# Altium schematic sheet Arduino_extension_connectors.SchDoc: Connectors
size A4; CompanyName: STMicroelectronics; Organization: Microcontrollers Division; SheetNumber: 5; SheetTotal: 8
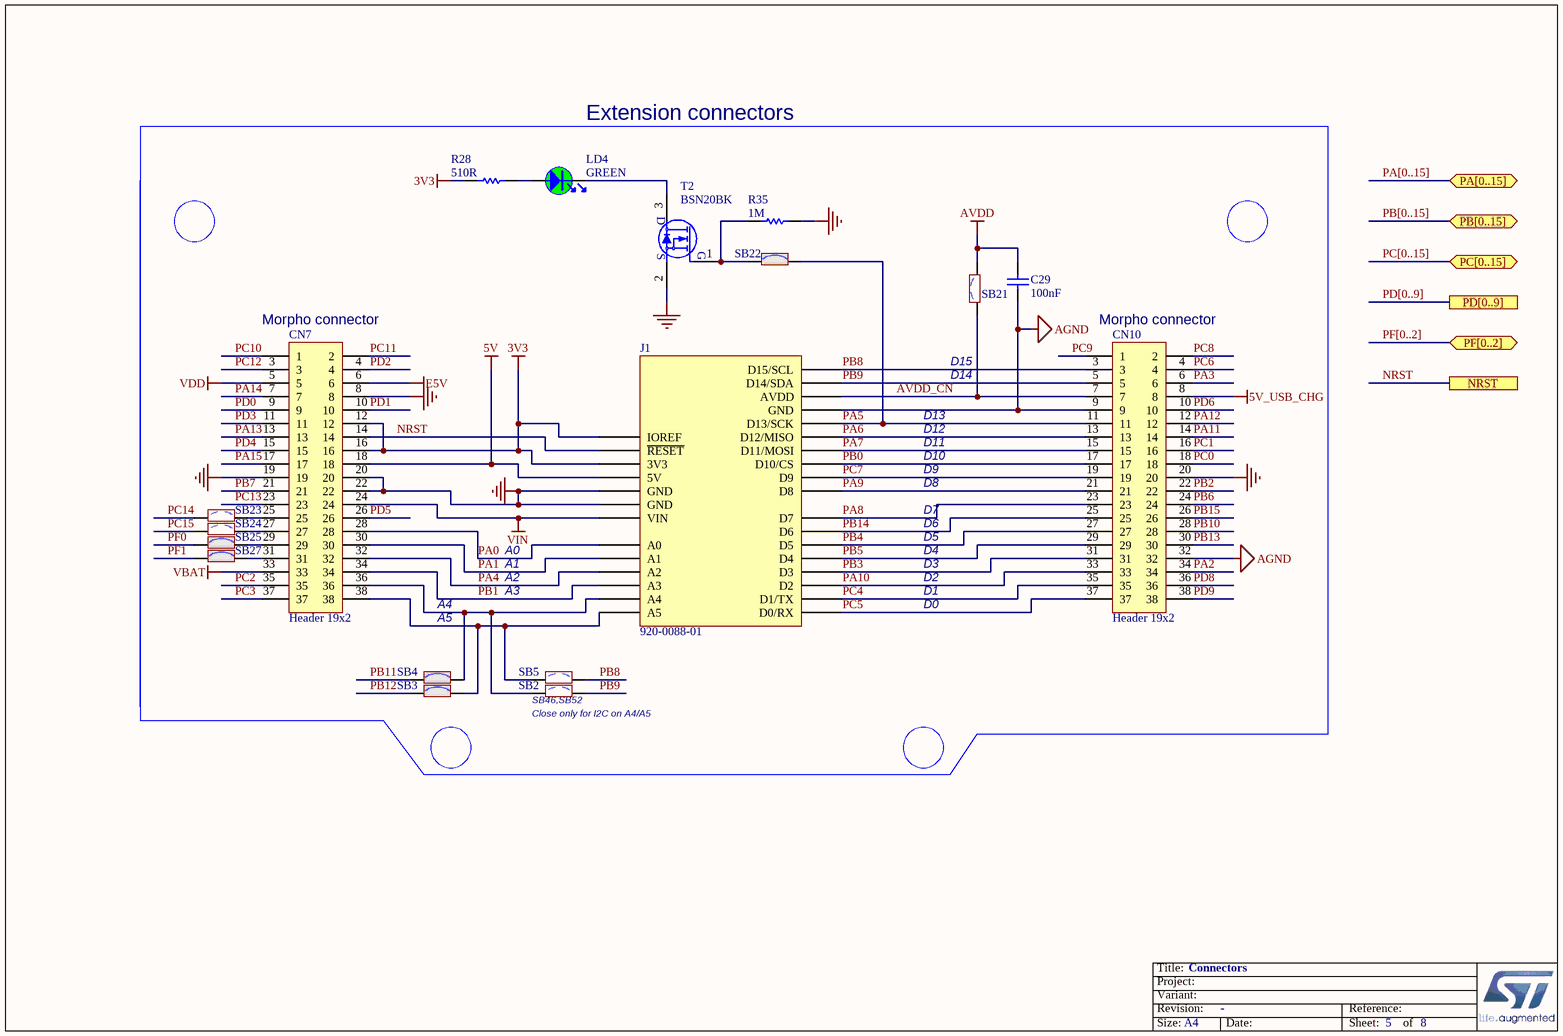
[diagram p0: Arduino_extension_connectors.SchDoc]

## Parts
C29  value 100nF  [C0603]  (hidden comment: Capacitor)
CN7  Header 19x2  [CON_SAMTEC_TSW-119-09-X-D]
CN10  Header 19x2  [CON_SAMTEC_TSW-119-09-X-D]
J1  920-0088-01  [SCHMARTBOARD - 920-0088-01]
LD4  value GREEN  [LED_0603_GREEN]  (hidden comment: LED_green)
R28  value 510R  [R0603]  (hidden comment: Resistor)
R35  value 1M  [R0603]  (hidden comment: Resistor)
SB2  SB_OFF  [SOLDER-BRIDGE_R0603-0R]  (value not drawn)
SB3  SB_ON  [SOLDER-BRIDGE_R0603-0R]  (value not drawn)
SB4  SB_ON  [SOLDER-BRIDGE_R0603-0R]  (value not drawn)
SB5  SB_OFF  [SOLDER-BRIDGE_R0603-0R]  (value not drawn)
SB21  SB_OFF  [SOLDER-BRIDGE_R0603-0R]  (value not drawn)
SB22  SB_ON  [SOLDER-BRIDGE_R0603-0R]  (value not drawn)
SB23  SB_OFF  [SOLDER-BRIDGE_R0603-0R]  (value not drawn)
SB24  SB_OFF  [SOLDER-BRIDGE_R0603-0R]  (value not drawn)
SB25  SB_ON  [SOLDER-BRIDGE_R0603-0R]  (value not drawn)
SB27  SB_ON  [SOLDER-BRIDGE_R0603-0R]  (value not drawn)
T2  value BSN20BK  [MOS_SOT23]  (hidden comment: BSN20)

## Ports
NRST, PA[0..15] (bidir), PB[0..15] (bidir), PC[0..15] (bidir), PD[0..9], PF[0..2] (bidir)

## Nets
3V3: CN7.12 CN7.16 J1.2(IOREF) J1.4(3V3) R28.2
5V: CN7.18 J1.5(5V)
5V_USB_CHG: CN10.8
AGND: C29.1 CN10.9 CN10.32 J1.29(GND)
AVDD: C29.2 SB21.2
E5V: CN7.6
GND: CN7.8 CN7.19 CN7.20 CN7.22 CN10.20 J1.6(GND) J1.7(GND) R35.2 T2.2(S)
VBAT: CN7.33
VDD: CN7.5
VIN: CN7.24 J1.8(VIN)
AVDD_CN: CN10.7 J1.30(AVDD) SB21.1
NRST: CN7.14 J1.3(~{RESET}) ; port NRST
PA0: CN7.28 J1.9(A0)
PA1: CN7.30 J1.10(A1)
PA2: CN10.34
PA3: CN10.6
PA4: CN7.32 J1.11(A2)
PA5: CN10.11 J1.28(D13/SCK) SB22.2
PA6: CN10.13 J1.27(D12/MISO)
PA7: CN10.15 J1.26(D11/MOSI)
PA8: CN10.23 J1.22(D7)
PA9: CN10.21 J1.23(D8)
PA10: CN10.33 J1.17(D2)
PA11: CN10.14
PA12: CN10.12
PA13: CN7.13
PA14: CN7.7
PA15: CN7.17
PB0: CN10.17 J1.25(D10/CS)
PB1: CN7.34 J1.12(A3)
PB2: CN10.22
PB3: CN10.31 J1.18(D3)
PB4: CN10.27 J1.20(D5)
PB5: CN10.29 J1.19(D4)
PB6: CN10.24
PB7: CN7.21
PB8: CN10.3 J1.32(D15/SCL) SB5.2
PB9: CN10.5 J1.31(D14/SDA) SB2.2
PB10: CN10.28
PB11: SB4.1
PB12: SB3.1
PB13: CN10.30
PB14: CN10.25 J1.21(D6)
PB15: CN10.26
PC0: CN10.18
PC1: CN10.16
PC2: CN7.35
PC3: CN7.37
PC4: CN10.35 J1.16(D1/TX)
PC5: CN10.37 J1.15(D0/RX)
PC6: CN10.4
PC7: CN10.19 J1.24(D9)
PC8: CN10.2
PC9: CN10.1
PC10: CN7.1
PC11: CN7.2
PC12: CN7.3
PC13: CN7.23
PC14: SB23.1
PC15: SB24.1
PD0: CN7.9
PD1: CN7.10
PD2: CN7.4
PD3: CN7.11
PD4: CN7.15
PD5: CN7.26
PD6: CN10.10
PD8: CN10.36
PD9: CN10.38
PF0: SB25.1
PF1: SB27.1
NetCN7_25: CN7.25 SB23.2
NetCN7_27: CN7.27 SB24.2
NetCN7_29: CN7.29 SB25.2
NetCN7_31: CN7.31 SB27.2
NetCN7_36: CN7.36 J1.13(A4) SB2.1 SB4.2
NetCN7_38: CN7.38 J1.14(A5) SB3.2 SB5.1
NetLD4_1: LD4.1 R28.1
NetLD4_2: LD4.2 T2.3(D)
NetR35_1: R35.1 SB22.1 T2.1(G)

## Buses and harness runs
bus PA[0..15] = port PA[0..15]
bus PB[0..15] = port PB[0..15]
bus PC[0..15] = port PC[0..15]
bus PD[0..9] = port PD[0..9]
bus PF[0..2] = port PF[0..2]

## Notes on the sheet
- Extension connectors
- (near CN7) Morpho connector
- D14
- D15
- (near CN10) Morpho connector
- D13
- D12
- D11
- D7
- D8
- D9
- D10
- A0
- A1
- A2
- D2
- D4
- D3
- D5
- D6
- A4
- A5
- A3
- D0
- D1
- (near SB2) Close only for I2C on A4/A5
- (near SB2) SB46,SB52
- Title:
- Project:
- Size:
- Revision:
- Variant:
- -
- Date:
- Reference:
- Sheet:
- of

## Library data of the parts
C29 = MCD-00211: Capacitor, MLCC, 100nF, 16V, X7R, 10%, 0603, T=0,8mm; Manufacturer_Part_Number: CC0603KRX7R7BB104; Manufacturer: YAGEO; ECCN_US: EAR99; ECCN_EU: NEC; Provided_By: SUBCO; Internal_Part_Number: MCD-00211; Status: Released; Part_Type: Capacitor; Package: C0603; ComponentLink1Description: Datasheet; ComponentLink1URL: http://tunmcdsvn.tun.st.com/Component_Datasheet_Library/Trunk/Capacitors/Yageo_Multilayer_Capacitor_X7R_series_100pF_to_22uF
CN7 CN10 = MCD-00213: Header, 19x2, 2,54mm, VR, TH, Height 5.84mm/10.16mm; Manufacturer_Part_Number: TSW-119-09-x-D; Manufacturer: SAMTEC; Part_Type: Connector; Provided_By: SUBCO; Internal_Part_Number: MCD-00213; Value: Header 19x2; ECCN_US: n/a; ECCN_EU: n/a; ComponentLink1Description: Datasheet; Status: Released; ComponentLink1URL: http://tunmcdsvn.tun.st.com/Component_Datasheet_Library/Trunk/Connectors/Samtec_TSW-HTSW-series; Parameter 1: *
J1 = 920-0088-01: CONN HDR 8/10P 0.1 GOLD PCB 6PC; Manufacturer: Schmartboard, Inc.; Connector Type: Header; Contact Length - Post: 0.413" (10.50mm); Number of Positions: 6, 8, 10; Number of Positions Loaded: All; Pitch - Mating: 0.100" (2.54mm); Style: Board to Board; System: Connector; Part Number: 920-0088-01; ComponentLink1Description: Datasheet; ComponentLink1URL: http://schmartboard.com/content/Brochures/920-0088-01.pdf; ComponentLink2Description: DigiKey Link; ComponentLink2URL: http://digikey.com/product-detail/en/schmartboard-inc/920-0088-01/1988-1036-ND/9559319; Contact Finish - Mating: Gold; Contact Finish - Post: Gold; Contact Type: Female Socket; Fastening Type: Push-Pull; Insulation Color: Black; Insulation Height: 0.335" (8.51mm); LastUpdated: 31/01/2020 20:49:58; Lifecycle Status: Active; Minimum Order: 1; Mounting Type: Through Hole; Number of Rows: 1; Packaging: Bulk; Part Status: Active; Price: 5.00; Series: -; Supplier 1: DigiKey; Supplier Part Number 1: 1988-1036-ND; Termination: Solder
LD4 = MCD-00050: LED, Green, 0603; Part_Type: Display; Manufacturer_Part_Number: 19-213SYGC/S530-E2/TR8; Manufacturer: EVERLIGHT; ECCN_US: EAR99; ECCN_EU: NEC; Provided_By: SUBCO; Internal_Part_Number: MCD-00050; Status: Released; ComponentLink1Description: Datasheet; ComponentLink1URL: http://tunmcdsvn.tun.st.com/Component_Datasheet_Library/Trunk/Display/Everlight_SMD-LED-GREEN_19-213SYGC-S530-XX-TR8-v3.doc; Package: LED 0603
R28 = MCD-00225: Resistor,510R,0603,1%,1/10W; Manufacturer_Part_Number: RC0603FR-07510RL; Manufacturer: YAGEO; ECCN_US: EAR99; ECCN_EU: NEC; Provided_By: SUBCO; Internal_Part_Number: MCD-00225; ComponentLink1Description: Datasheet; Status: Released; Part_Type: Resistor; Package: R0603; ComponentLink1URL: http://tunmcdsvn.tun.st.com/Component_Datasheet_Library/Trunk/Resistors/Yageo_Resistor_RC0603-series
R35 = MCD-00257: Resistor,1M,0603,1%,1/10W; Manufacturer_Part_Number: RC0603FR-071ML; Manufacturer: YAGEO; ECCN_US: EAR99; ECCN_EU: NEC; Provided_By: SUBCO; Internal_Part_Number: MCD-00257; Status: Released; Part_Type: Resistor; Package: R0603; ComponentLink1Description: Datasheet; ComponentLink1URL: http://tunmcdsvn.tun.st.com/Component_Datasheet_Library/Trunk/Resistors/Yageo_Resistor_RC0603-series
SB2 SB5 SB21 SB23 SB24 = MCD-00072: Solder Bridge OFF; Part_Type: Mechanical; Manufacturer_Part_Number: RC0603JR-070RL; Manufacturer: YAGEO; Provided_By: SUBCO; Internal_Part_Number: MCD-00072; Status: Released; ECCN_US: n/a; ECCN_EU: n/a; Package: SB0603; ComponentLink1Description: Datasheet; ComponentLink1URL: http://tunmcdsvn.tun.st.com/Component_Datasheet_Library/Trunk/Resistors/Yageo_Resistor_RC0603-series
SB3 SB4 SB22 SB25 SB27 = MCD-00071: Solder Bridge ON; Part_Type: Mechanical; Manufacturer_Part_Number: RC0603JR-070RL; Manufacturer: YAGEO; Provided_By: SUBCO; Internal_Part_Number: MCD-00071; ECCN_US: n/a; ECCN_EU: n/a; Status: Released; Package: SB0603; ComponentLink1Description: Datasheet; ComponentLink1URL: http://tunmcdsvn.tun.st.com/Component_Datasheet_Library/Trunk/Resistors/Yageo_Resistor_RC0603-series
T2 = MCD-01969: N-channel enhancement mode field-effect transistor; Manufacturer: NEXPERIA; ECCN_US: EAR99; ECCN_EU: NEC; Provided_By: SUBCO; Internal_Part_Number: MCD-01969; Status: Checked; Part_Type: Transistor; Manufacturer_Part_Number: BSN20BK; ComponentLink1Description: Datasheet; ComponentLink1URL: http://tunmcdsvn.tun.st.com/Component_Datasheet_Library/Trunk/IC/NXP_Transistor_BSN20BK_SOT23; Package: BSN20BK